# EasyEDA schematic EasyEDA_schema.json
TITLE: Sheet_1; REV: 1.0; Date: 2022-05-25; Sheet: 1/1; Company: Your Company
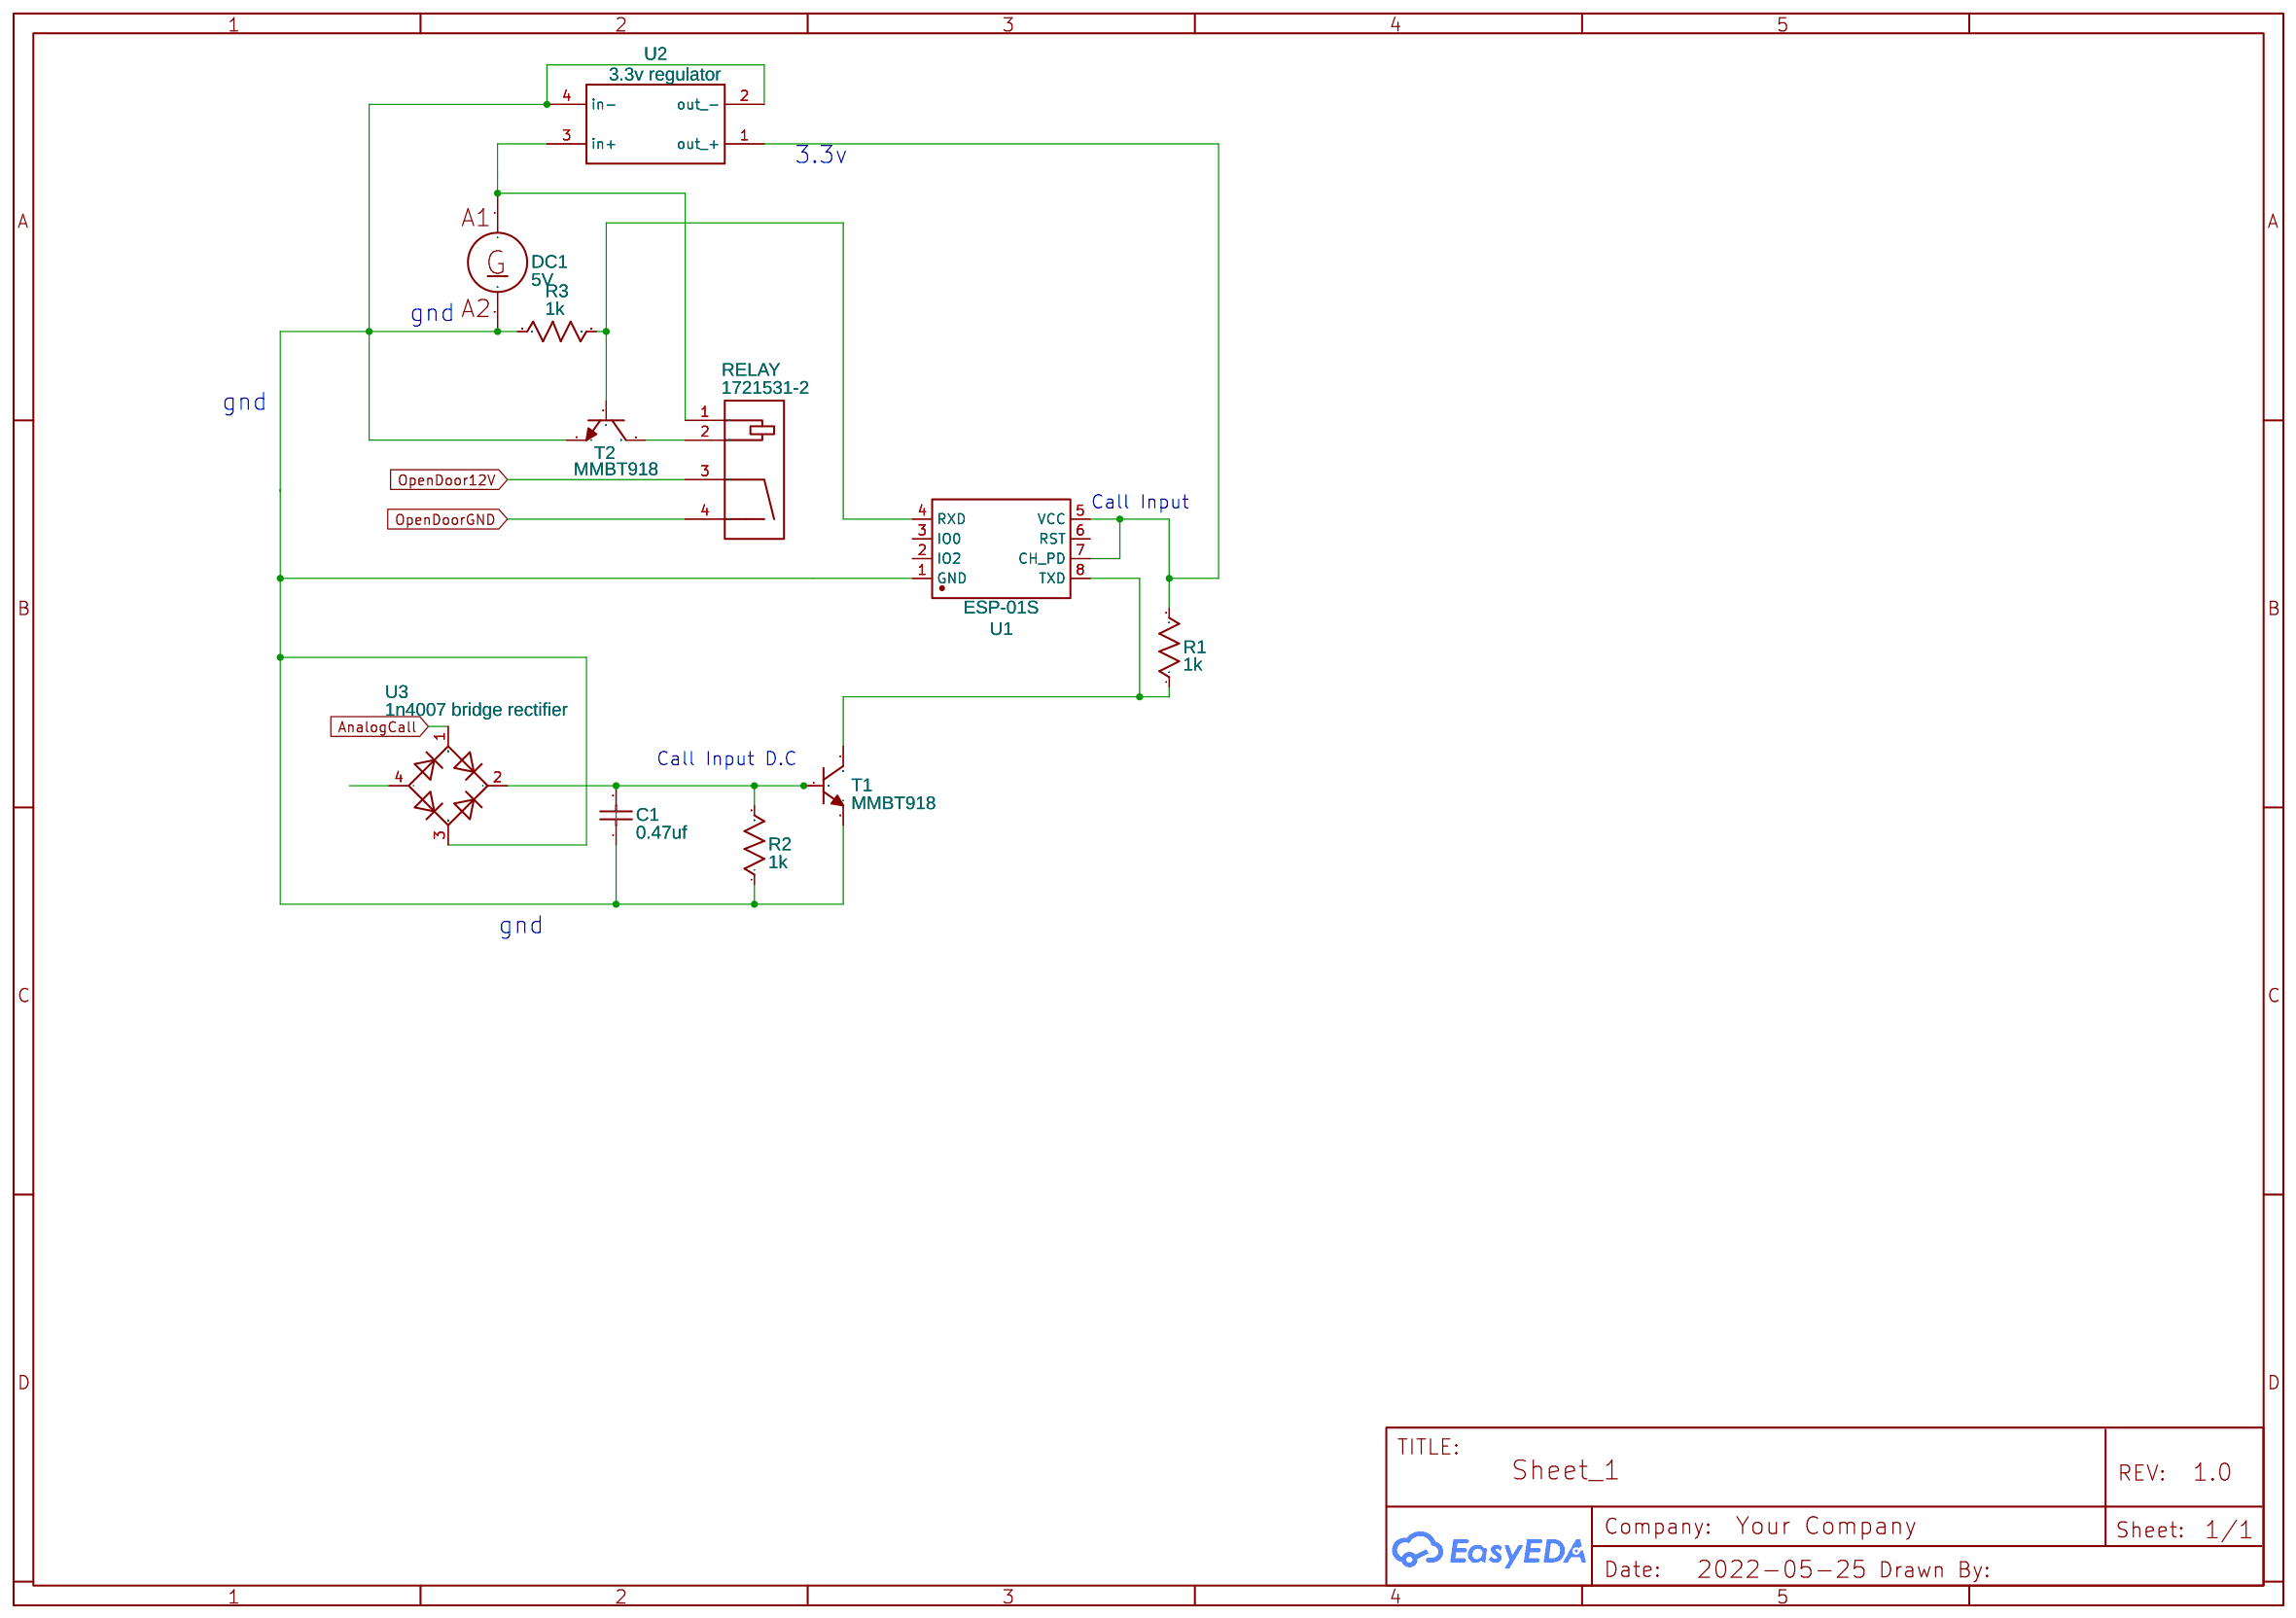
[diagram p0: schematic sheet]

## Parts
C1  0.47uf  [FILMCAPACITOR15]
DC1  5V
R1  1k  [R0603]
R2  1k  [R0603]
R3  1k  [R0603]
RELAY  1721531-2  [RELAY-TH_1721531-2]
T1  MMBT918  [SOT-23-3_L2.9-W1.3-P1.90-LS2.4-BR]
T2  MMBT918  [SOT-23-3_L2.9-W1.3-P1.90-LS2.4-BR]
U1  ESP-01S  [WIFIM-TH_ESP-01S]
U2  3.3v regulator  [3.3 REGULATOR]
U3  1n4007 bridge rectifier  [1N4007 BRIDGE RECTIFIER]

## Library data of the parts
C1 = 0.47uf: Voltage: 25V; Tolerance: 20%; EasyEDA: E54367; Supplier Part: E54367; Supplier: EasyEDA; Manufacturer: Vishay; Manufacturer Part: BFC241674704
DC1 = DC generator 1: Contributor: Giuliahuo
R1-R3 = R_0603_US: Contributor: LCEDA_Lib
RELAY = 1721531-2: Supplier: LCSC; Supplier Part: C355422; Manufacturer: TE Connectivity; Contributor: LCSC; JLCPCB Part Class: Extended Part
T1 T2 = MMBT918: Supplier: LCSC; Supplier Part: C184118; Manufacturer: ON Semicon; Contributor: LCSC; JLCPCB Part Class: Extended Part
U1 = ESP-01S: Supplier: LCSC; Manufacturer: Ai-Thinker; Supplier Part: C111009
U2 = 3.3v regulator: Contributor: Yajesh
U3 = 1n4007 bridge rectifier: Contributor: luca.giudici

## Nets
AnalogCall: U3.1(C1)
OpenDoor12V: RELAY.3
OpenDoorGND: RELAY.4
Net-(C1-1): C1.1 DC1.2 R2.1 R3.1 T1.2(E) T2.2(E) U1.1(GND) U2.2(out -) U2.4(in-) U3.3(C2)
Net-(C1-2): C1.2 R2.2 T1.1(B) U3.2(+)
Net-(DC1-1): DC1.1 RELAY.1 U2.3(in+)
Net-(R1-1): R1.1 T1.3(C) U1.8(TXD)
Net-(R1-2): R1.2 U1.5(VCC) U1.7(CH_PD) U2.1(out +)
Net-(R3-2): R3.2 T2.1(B) U1.4(RXD)
Net-(RELAY-2): RELAY.2 T2.3(C)

Not connected (* = marked no-connect by the designer): U1 2(IO2) 3(IO0) 6(RST); U3 4(-)

## Notes on the sheet
- 3.3v
- gnd
- gnd
- Call Input
- Call Input D.C
- gnd
